# Altium schematic sheet Sheet3.SchDoc
size A4
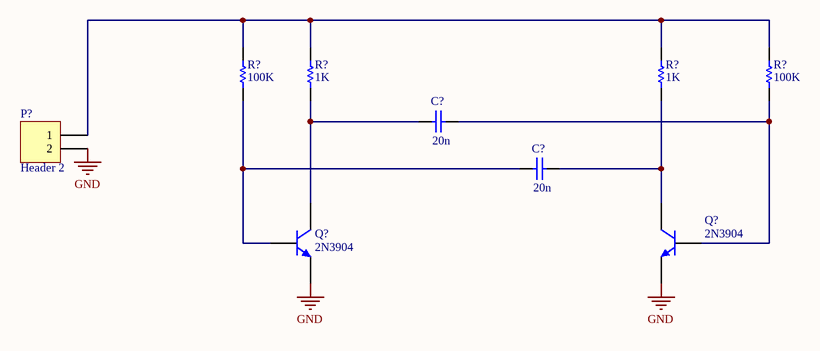
[diagram p0: Sheet3.SchDoc]

## Parts
(Parts that share a designator on the sheet are numbered #1, #2 ... from top to bottom, then left to right.)
C?#1  value 20n  [RAD-0.3]  (hidden comment: Cap)
C?#2  value 20n  [RAD-0.3]  (hidden comment: Cap)
P?  Header 2  [HDR1X2]
Q?#1  2N3904  [TO-92A]
Q?#2  2N3904  [TO-92A]
R?#1  value 100K  [AXIAL-0.3]  (hidden comment: Res1)
R?#2  value 1K  [AXIAL-0.3]  (hidden comment: Res1)
R?#3  value 1K  [AXIAL-0.3]  (hidden comment: Res1)
R?#4  value 100K  [AXIAL-0.3]  (hidden comment: Res1)

## Nets
GND: P?.2 Q?#1.1(E) Q?#2.1(E)
NetC?#1_1: C?#1.1 Q?#1.3(C) R?#2.1
NetC?#1_2: C?#1.2 Q?#2.2(B) R?#4.1
NetC?#2_1: C?#2.1 Q?#1.2(B) R?#1.1
NetC?#2_2: C?#2.2 Q?#2.3(C) R?#3.1
NetP?_1: P?.1 R?#1.2 R?#2.2 R?#3.2 R?#4.2

## Library data of the parts
C?#1 C?#2 = Cap: Capacitor; Published: 8-Jun-2000; LatestRevisionDate: 17-Jul-2002; LatestRevisionNote: Re-released for DXP Platform.; PackageReference: RAD-0.3; Publisher: Altium Limited; PackageDescription: Radial Cap, Thru-Hole; 2 Leads; 0.3 in Pin Spacing
P? = Header 2: Header, 2-Pin; LatestRevisionDate: 17-Jul-2002; LatestRevisionNote: Re-released for DXP Platform.; Publisher: Altium Limited
Q?#1 Q?#2 = 2N3904: NPN General Purpose Amplifier; Published: 8-Jun-2000; LatestRevisionDate: 17-Jan-2003; LatestRevisionNote: PCB Footprint replaced; DatasheetVersion: 1997; PackageVersion: Sep-1998; PackageReference: TO-92A; Publisher: Altium Limited; PackageDescription: TO, Flat Index; 3 In-Line, Axial Leads; Body Dia. 4.5mm; Leads 0.51 x 0.48 mm (max); ComponentLink1Description: Manufacturer Link; ComponentLink1URL: http://www.fairchildsemi.com/; ComponentLink2Description: Datasheet; ComponentLink2URL: http://www.fairchildsemi.com/ds/2N%2F2N3904.pdf
R?#1-R?#4 = Res1: Resistor; Published: 8-Jun-2000; LatestRevisionDate: 17-Jul-2002; LatestRevisionNote: Re-released for DXP Platform.; PackageReference: AXIAL-0.3; Publisher: Altium Limited; PackageDescription: Axial Device, Thru-Hole; 2 Leads; 0.3 in Pin Spacing